# Altium project Arduino Challenge.PrjPcb
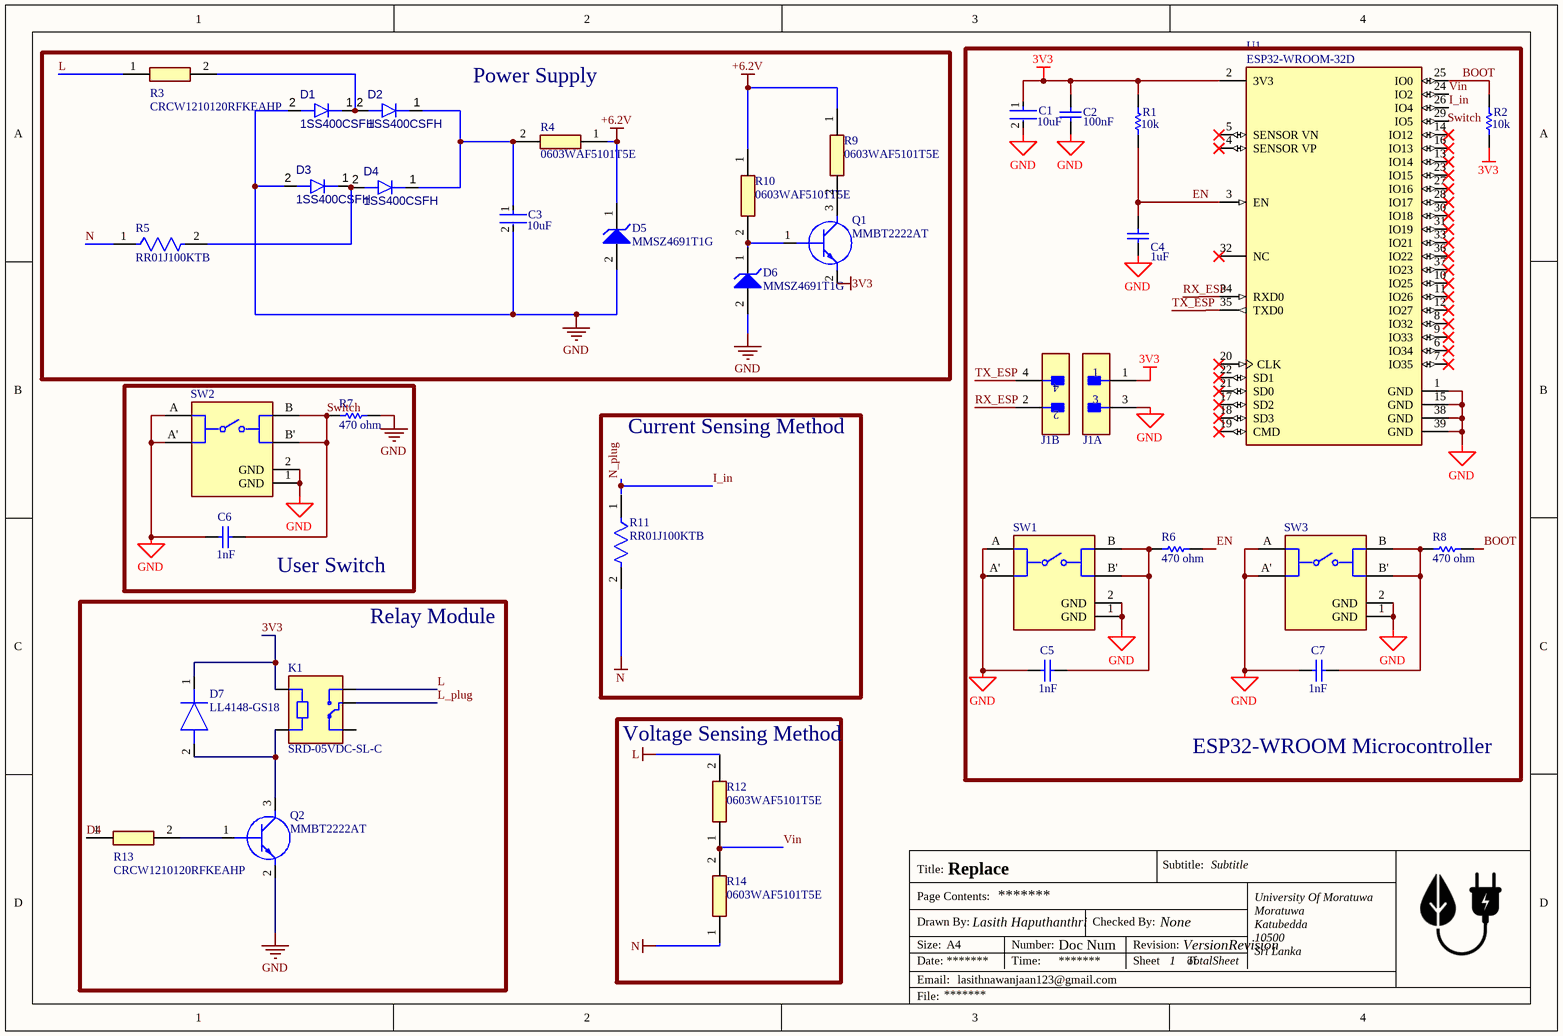
[diagram p0: Sheet1.SchDoc]
1 sheet, 36 parts. Net scope: global (net labels, ports and power ports of the same name join across sheets).
Board file: PCB2.PcbDoc

## Sheet Sheet1.SchDoc: Title
size A4; Date: *******; ApprovedBy: *******; CheckedBy: None; Author: *******; CompanyName: *******; DrawnBy: Name; Engineer: *******; Organization: *******; Address1: *******; Address2: *******; Address3: *******; Address4: *******; DocumentNumber: Doc Num; Revision: *******; SheetNumber: 1; SheetTotal: 1; Subtitle: Subtitle; Project: Replace; VersionRevision: VersionRevision; TotalSheet: TotalSheet; CurrentTime: *******; CurrentDate: *******; Time: *******; DocumentFullPathAndName: *******; DocumentName: *******; ModifiedDate: *******; ImagePath: *******; ProjectName: *******; Application_BuildNumber: *******

### Parts
C1  Capacitance: 10uF  [FP-1206-L_3_2_0_2-W_1_6_0-IPC_B]  (hidden comment: 1206YD106KAT2A)
C2  value 100nF  [CAPC2013X140X50LL20T25]  (hidden comment: 08055F104KAT2A)
C3  Capacitance: 10uF  [FP-1206-L_3_2_0_2-W_1_6_0-IPC_B]  (hidden comment: 1206YD106KAT2A)
C4  Parameter 1: 1uF  [CAPC2013X145X50LL20T25]  (hidden comment: C0805C105K4PACTU)
C5  Parameter 1: 1nF  [CAPC2013X145X48LL20T23]  (hidden comment: VJ0805D102KXAAJ)
C6  Parameter 1: 1nF  [CAPC2013X145X48LL20T23]  (hidden comment: VJ0805D102KXAAJ)
C7  Parameter 1: 1nF  [CAPC2013X145X48LL20T23]  (hidden comment: VJ0805D102KXAAJ)
D1  1SS400CSFH  [ROHM-VMN2-2_V]
D2  1SS400CSFH  [ROHM-VMN2-2_V]
D3  1SS400CSFH  [ROHM-VMN2-2_V]
D4  1SS400CSFH  [ROHM-VMN2-2_V]
D5  MMSZ4691T1G  [ONSC-SOD-123-2-425-04_V]
D6  MMSZ4691T1G  [ONSC-SOD-123-2-425-04_V]
D7  LL4148-GS18  [SOD-80]
J1  PEC02DABN  [FP-PEC02DABN-MFG]  (value not drawn)  (parts A,B of 2)
K1  SRD-05VDC-SL-C  [RELAY_SRD-05VDC-SL-C]
Q1  MMBT2222AT  [SOTFL50P160X78-3N]
Q2  MMBT2222AT  [SOTFL50P160X78-3N]
R1  Parameter 1: 10k  [RESC2013X60X35NL10T20]  (hidden comment: RC0805FR-0710KL)
R2  Parameter 1: 10k  [RESC2013X60X35NL10T20]  (hidden comment: RC0805FR-0710KL)
R3  CRCW1210120RFKEAHP  [RESC3225X70N]
R4  0603WAF5101T5E  [RESC1608X55N]
R5  RR01J100KTB  [FP-RR01-MFG]
R6  Parameter 1: 470 ohm  [RESC2013X50X30LL20T20]  (hidden comment: CRCW0805470RFKEA)
R7  Parameter 1: 470 ohm  [RESC2013X50X30LL20T20]  (hidden comment: CRCW0805470RFKEA)
R8  Parameter 1: 470 ohm  [RESC2013X50X30LL20T20]  (hidden comment: CRCW0805470RFKEA)
R9  0603WAF5101T5E  [RESC1608X55N]
R10  0603WAF5101T5E  [RESC1608X55N]
R11  RR01J100KTB  [FP-RR01-MFG]
R12  0603WAF5101T5E  [RESC1608X55N]
R13  CRCW1210120RFKEAHP  [RESC3225X70N]
R14  0603WAF5101T5E  [RESC1608X55N]
SW1  EVQ-PLMA15  [FP-EVQ-PLMA15-MFG]  (value not drawn)
SW2  EVQ-PLMA15  [FP-EVQ-PLMA15-MFG]  (value not drawn)
SW3  EVQ-PLMA15  [FP-EVQ-PLMA15-MFG]  (value not drawn)
U1  ESP32-WROOM-32D  [FP-ESP32-WROOM-32D-MFG]

### Blocks framed on the sheet
Power Supply: C3 D1-D6 Q1 R3-R5 R9 R10
ESP32-WROOM Microcontroller: C1 C2 C4 C5 C7 J1 R1 R2 R6 R8 SW1 SW3 U1
User Switch: C6 R7 SW2
Current Sensing Method: R11
Relay Module: D7 K1 Q2 R13
Voltage Sensing Method: R12 R14

### Nets
3V3: C1.1 C2.2 D7.1(K) J1.1 K1.A1 Q1.2(E) R1.2 R2.1 U1.2(3V3)
+6.2V: D5.1(K) R4.1 R9.1 R10.1
GND: C1.2 C2.1 C3.2 C4.1 C5.1 C6.1 C7.1 D1.2(A) D3.2(A) D5.2(A) D6.2(A) J1.3 Q2.2(E) R7.2 SW1.1(GND) SW1.2(GND) SW1.A SW1.A' SW2.1(GND) SW2.2(GND) SW2.A SW2.A' SW3.1(GND) SW3.2(GND) SW3.A SW3.A' U1.1(GND) U1.15(GND) U1.38(GND) U1.39(GND)
L: K1.NO R3.1 R12.2
N: R5.1 R11.2 R14.1
BOOT: R2.2 R8.2 U1.25(IO0)
D4: R13.1
EN: C4.2 R1.1 R6.2 U1.3(EN)
I_in: U1.26(IO4)  [also labelled N_plug]
L_plug: K1.COM
RX_ESP: J1.2 U1.34(RXD0)
Switch: C6.2 R7.1 SW2.B SW2.B'
TX_ESP: J1.4 U1.35(TXD0)
Vin: R12.1 R14.2 U1.24(IO2)
NetC3_1: C3.1 D2.1(K) D4.1(K) R4.2
NetC5_2: C5.2 R6.1 SW1.B SW1.B'
NetC7_2: C7.2 R8.1 SW3.B SW3.B'
NetD1_1: D1.1(K) D2.2(A) R3.2
NetD3_1: D3.1(K) D4.2(A) R5.2
NetD6_1: D6.1(K) Q1.1(B) R10.2
NetD7_2: D7.2(A) K1.A2 Q2.3(C)
NetQ1_3: Q1.3(C) R9.2
NetQ2_1: Q2.1(B) R13.2

Not connected (* = marked no-connect by the designer): K1 NC; R11 1; U1 4(SENSOR_VP)* 5(SENSOR_VN)* 6(IO34)* 7(IO35)* 8(IO32)* 9(IO33)* 10(IO25)* 11(IO26)* 12(IO27)* 13(IO14)* 14(IO12)* 16(IO13)* 17(SD2)* 18(SD3)* 19(CMD)* 20(CLK)* 21(SD0)* 22(SD1)* 23(IO15)* 27(IO16)* 28(IO17)* 29(IO5) 30(IO18)* 31(IO19)* 32(NC)* 33(IO21)* 36(IO22)* 37(IO23)*

### Notes on the sheet
- Labels drawn without touching a wire or pin: Switch
- Title:
- Drawn By:
- Page Contents:
- Checked By:
- Subtitle:
- University Of Moratuwa
- Moratuwa
- Size:
- Date:
- File:
- Email:
- A4
- lasithnawanjaan123@gmail.com
- Lasith Haputhanthri
- Number:
- Time:
- Revision:
- Sheet
- of
- Katubedda
- 10500
- Sri Lanka

### Library data of the parts
C1 C3 = CMP-04427-000082-1: General Purpose Ceramic Capacitor, 1206, 10uF, 10%, X5R, 15%, 16V; Max Operating Temperature: 85°C; Tolerance: 10%; Dielectric: X5R; Series: -; Case Code (Imperial): 1206; Width: 1.6mm; Termination: SMD/SMT; Voltage Rating: 16V; REACH SVHC: No SVHC; Length: 3.2mm; Size: 1.78mm; Package Quantity: 1; Voltage: 16V; RoHS Compliant: Yes; Thickness: 0.07inch; Mount: Surface Mount; Radiation Hardening: No; Voltage Rating (DC): 16V; Min Operating Temperature: -55°C; Case Code (Metric): 3216; Construction: Flat; Depth: 1.6mm; Height: 0.07mm; Lead Free: Lead Free; Number of Pins: 2; Case/Package: 1206; Packaging: Tape and Reel
C2 = CMP-2007-04784-1: Manufacturer: AVX Interconnect / Elco; Part Number: 08055F104KAT2A
C4 = CMP-1036-04746-2: Manufacturer: Kemet; Part Number: C0805C105K4PACTU
C5-C7 = CMP-2007-03135-1: Manufacturer: Vitramon; Part Number: VJ0805D102KXAAJ
D1-D4 = CMP-004-00022-3: Switching Diode (High Speed Switching), 80 V, 100 mA, 2-Pin SOD-923, RoHS, Tape and Reel; Pins: 2; Mounting Technology: SMT
D5 D6 = CMP-1060-00606-1: Zener Voltage Regulator, 500 mW, 2-Pin SOD-123, Pb-Free, Tape and Reel; Manufacturer: On Semiconductor; VZ Typ (V): 6.2; P Max (W): 0.5; DatasheetVersion: Rev. 9; ComponentLink1Description: Manufacturer URL; PackageReference: SOD-123-2-425-04; PartNumber: MMSZ4691T1G; RoHS: Pb-Free; Mounting Technology: Surface Mount; ComponentLink3URL: http://www.onsemi.com/pub_link/Collateral/425-04.PDF; Packing: Tape and Reel; ComponentLink2URL: http://www.onsemi.com/pub_link/Collateral/MMSZ4678T1-D.PDF; PackageVersion: Rev. G, 10/2009; ComponentLink1URL: http://www.onsemi.com/; PackageDescription: 2-Pin SOD, Body 1.6 x 2.69 mm; ComponentLink2Description: Datasheet; ComponentLink3Description: Package Specification
D7 = LL4148-GS18: Diode; Manufacturer_Name: Vishay; Datasheet Link: https://www.vishay.com/docs/85557/ll4148.pdf; Manufacturer_Part_Number: LL4148-GS18; Mouser Part Number: 78-LL4148-GS18; Mouser Price/Stock: https://www.mouser.co.uk/ProductDetail/Vishay-Semiconductors/LL4148-GS18?qs=YkIJFe%252BtFEUsKqcD4T1jvg%3D%3D; Arrow Part Number: LL4148-GS18; Arrow Price/Stock: https://www.arrow.com/en/products/ll4148-gs18/vishay?region=europe
J1 = CMP-25680-000069-1: CONN HEADER VERT 4POS 2.54MM; Number of Contacts: 4; Row Spacing: 0.1inch; Connector Type: Male Pin; Gender: Male; Series: -; Housing Material: Plastic; Contact Material: Bronze; Length: 5.08mm; RoHS Compliant: Yes; Width: 5.08mm; Min Operating Temperature: -65°C; Contact Shape: Square; Pitch: 0.1inch; Lead Free: Lead Free; Number of Positions: 4; Fastening Type: Pull; Contact Plating: Tin; Flammability Rating: UL94 V-0; Packaging: Bulk; Termination: Solder; Max Operating Temperature: 125°C; Package Quantity: 1; Number of Rows: 2; Contact Mating Length: 0.23inch; Contact Finish - Mating: TIN; Height: 2.54mm; Insulation Color: Black; Mount: Through Hole; Insulation Material: PBT; Color: Black; Housing Color: Black; Contact Type: Male Pin
K1 = SRD-05VDC-SL-C: 5V Trigger Relay Module For Arduino And Raspberry Pi 5V Trigger Relay Module For Arduino And Raspberry Pi; MF: Songle Relay; Check_prices: https://www.snapeda.com/parts/SRD-05VDC-SL-C/Songle+Relay/view-part/?ref=eda; Value: *; Availability: Not in stock; Price: None; Package: NON STANDARD-5 Songle Relay; MP: SRD-05VDC-SL-C; SnapEDA_Link: https://www.snapeda.com/parts/SRD-05VDC-SL-C/Songle+Relay/view-part/?ref=snap
Q1 Q2 = MMBT2222AT: Transistor BJT NPN; Manufacturer_Name: onsemi; Datasheet Link: http://www.onsemi.com/pub/Collateral/MMBT2222ATT1-D.PDF; Height: 0.78mm; Manufacturer_Part_Number: MMBT2222AT; Mouser Part Number: 512-MMBT2222AT; Mouser Price/Stock: https://www.mouser.co.uk/ProductDetail/ON-Semiconductor-Fairchild/MMBT2222AT/?qs=olBtUnqRSekpPcGAXqyohQ%3D%3D; Arrow Part Number: MMBT2222AT; Arrow Price/Stock: https://www.arrow.com/en/products/mmbt2222at/on-semiconductor
R1 R2 = CMP-1659-00013-4: Chip Resistor, 10 KOhm, +/- 1%, 0.125 W, -55 to 155 degC, 0805 (2012 Metric), RoHS, Tape and Reel; Manufacturer: Yageo; Voltage Rating: 150 V; Mount: Surface Mount; ComponentLink1Description: Manufacturer URL; ComponentLink2URL: http://www.yageo.com/documents/recent/PYu-RC_Group_51_RoHS_L_04.pdf; Pins: 2; Length: 2 mm; Min Operating Temperature: -55 degC; Height: 0.5 mm; Mounting Technology: Surface Mount; RoHSCompliant: true; REACH SVHC: No SVHC; ComponentLink1URL: http://www.yageo.com/; Max Operating Temperature: 155 degC; PackageReference: 0805; DatasheetVersion: Rev. 4, 02/2016; Package Quantity: 5000; Packaging: Tape and Reel; ComponentLink2Description: Datasheet; PackageDescription: 2-Pin Surface Mounted Device, Body 2 x 1.25 mm
R3 R13 = CRCW1210120RFKEAHP: Resistor; Manufacturer_Name: Vishay; Datasheet Link: http://componentsearchengine.com/Datasheets/1/CRCW1210120RFKEAHP.pdf; Height: 0.7mm; Manufacturer_Part_Number: CRCW1210120RFKEAHP; Mouser Part Number: 71-CRCW1210120RFKEAH; Mouser Price/Stock: https://www.mouser.co.uk/ProductDetail/Vishay-Dale/CRCW1210120RFKEAHP?qs=OAzHGkhREL38%2FX7kAmU4KQ%3D%3D; Arrow Part Number: CRCW1210120RFKEAHP; Arrow Price/Stock: https://www.arrow.com/en/products/crcw1210120rfkeahp/vishay?region=nac
R4 R9 R10 R12 R14 = 0603WAF5101T5E: Resistor; Manufacturer_Name: UNI-ROYAL(Uniroyal Elec); Datasheet Link: https://datasheet.lcsc.com/szlcsc/Uniroyal-Elec-0603WAF5101T5E_C23186.pdf; Height: 0.55mm; Manufacturer_Part_Number: 0603WAF5101T5E
R5 R11 = CMP-03212-000008-1: RES 100K OHM 5% 1W AXIAL; Number of Resistors: 1; Temperature Coefficient: 300ppm/°C; Voltage Rating: 350V; Resistance: 100kR; Package Quantity: 5000; Power Rating: 1W; Packaging: Ammo Pack; Min Operating Temperature: -55°C; Number of Terminations: 2; Resistor Type: Power resistor; Length: 6.8mm; ELV: Compliant; Mount: Axial; RoHS Compliant: Yes; Case/Package: Metal; Diameter: 2.6mm; Termination: Axial; Series: RR; Max Operating Temperature: 155°C; Tolerance: 5%
R6-R8 = CMP-2001-03932-1: Manufacturer: Vishay Dale; Part Number: CRCW0805470RFKEA
SW1-SW3 = CMP-05618-000006-1: SWITCH TACTILE SPST-NO 0.02A 15V; Manufacturer: Panasonic Electronic Components; Operating Force: 2.6N; Contact Resistance: 50mΩ; Contact Current Rating: 20mA; Electromechanical Life: 200000Cycles; Throw Configuration: SPST-NO; Automotive: No; Digikey Description: SWITCH TACTILE SPST-NO 0.02A 15V; Device Class L3: Tactile Switches; Device Class L2: Switches; Temperature Range Low: -20°C; ComponentLink2Description: Datasheet; RoHS: TRUE; Mount: Surface Mount; Package: 0; Height: 1.7mm; Octopart: https://octopart.com/evq-plma15-panasonic-39850235; Temperature Range High: +70°C; Device Class L1: Electromechanical; Category: Switch; Mouser Description: Tactile Switches FLAT ACT 2.6NF 4.6x3.4x1.5mm; Voltage Rating Dc: 15V; Manufacturer Part Number: EVQ-PLMA15; ComponentLink2URL: https://datasheet.ciiva.com/8164/atv0000ce2-8164994.pdf; Lead Free: Yes; Temperature: -20°C to +70°C
U1 = CMP-194065-000003-1: WIFI MODULE 32MBITS SPI FLASH; Manufacturer: Espressif Systems; Max Supply Voltage: 3.6V; Nominal Supply Current: 500mA; Max Frequency: 2484MHz; Number Of Adc Channels: 16; Number Of Gpio: 32; Interface: I2C,SPI,UART,Ethernet,I2S,Other; Data Rate: 150Mbits/s; Min Supply Voltage: 3V; Bandwidth: 72MHz; Sensitivity: -98dBm; Octopart: https://octopart.com/esp32-wroom-32d-espressif+systems-91040050; Package: ESP32-WROOM-32D; ComponentLink2URL: https://www.espressif.com/sites/default/files/documentation/esp32-wroom-32d_esp32-wroom-32u_datasheet_en.pdf; Lead Free: Yes; Category: UNK; Mouser Description: Wi-Fi/BT BLE Module ESP32-D0WD, SPI Flash, UART, P; Device Class L1: Integrated Circuits (ICs); RoHS: TRUE; Temperature Range Low: -40°C; ComponentLink2Description: Datasheet; Digikey Description: WIFI MODULE 32MBITS SPI FLASH; Height: 3.2mm; Temperature: -40°C to +85°C; Manufacturer Part Number: ESP32-WROOM-32D; Device Class L3: Transceivers; Device Class L2: RF Semiconductors and Devices; Temperature Range High: +85°C; Automotive: No